# Altium schematic sheet IO.SchDoc
size A
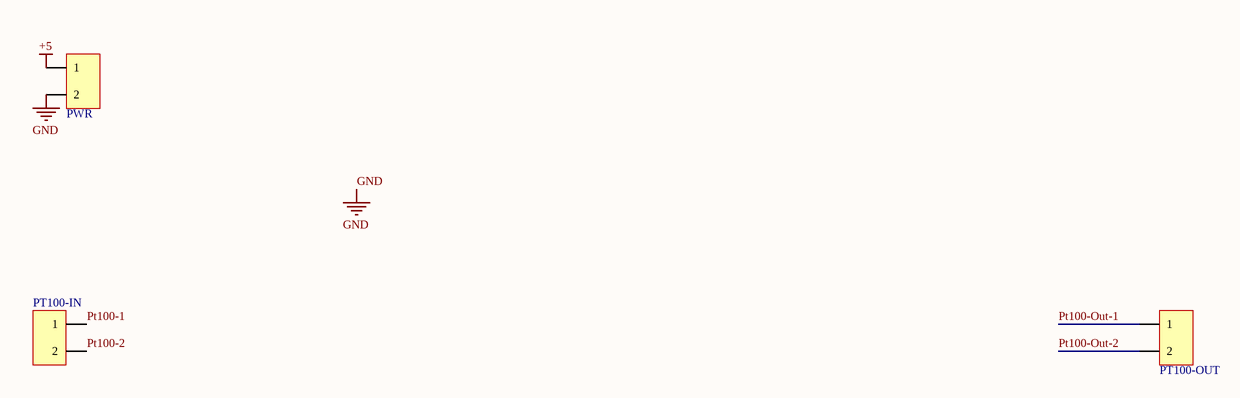
[diagram p0: IO.SchDoc]

## Parts
PT100-IN  691253510002  [691253510002]  (value not drawn)
PT100-OUT  691253510002  [691253510002]  (value not drawn)
PWR  691253510002  [691253510002]  (value not drawn)

## Nets
+5: PWR.1
GND: PWR.2
Pt100-1: PT100-IN.1
Pt100-2: PT100-IN.2
Pt100-Out-1: PT100-OUT.1
Pt100-Out-2: PT100-OUT.2

## Library data of the parts
PT100-IN PT100-OUT PWR = 691253510002: Horizontal Cable Entry with Rising Cage Clamp, Serie 2535 - 5.08mm; Manufacturer: Wurth Elektronik; ComponentLink1 Description: Manufacturer; ComponentLink2 Description: Datasheet; NoPins: 2; ComponentLink1 URL: http://www.we-online.com; ComponentLink2 URL: http://katalog.we-online.de/em/datasheet/6912535100xx.pdf; Created By: Baojun Chen; Created Date: 27.Aug.2015; PartNo: 691253510002